# EAGLE design Circuit schematic (EAGLE 7.5.0)
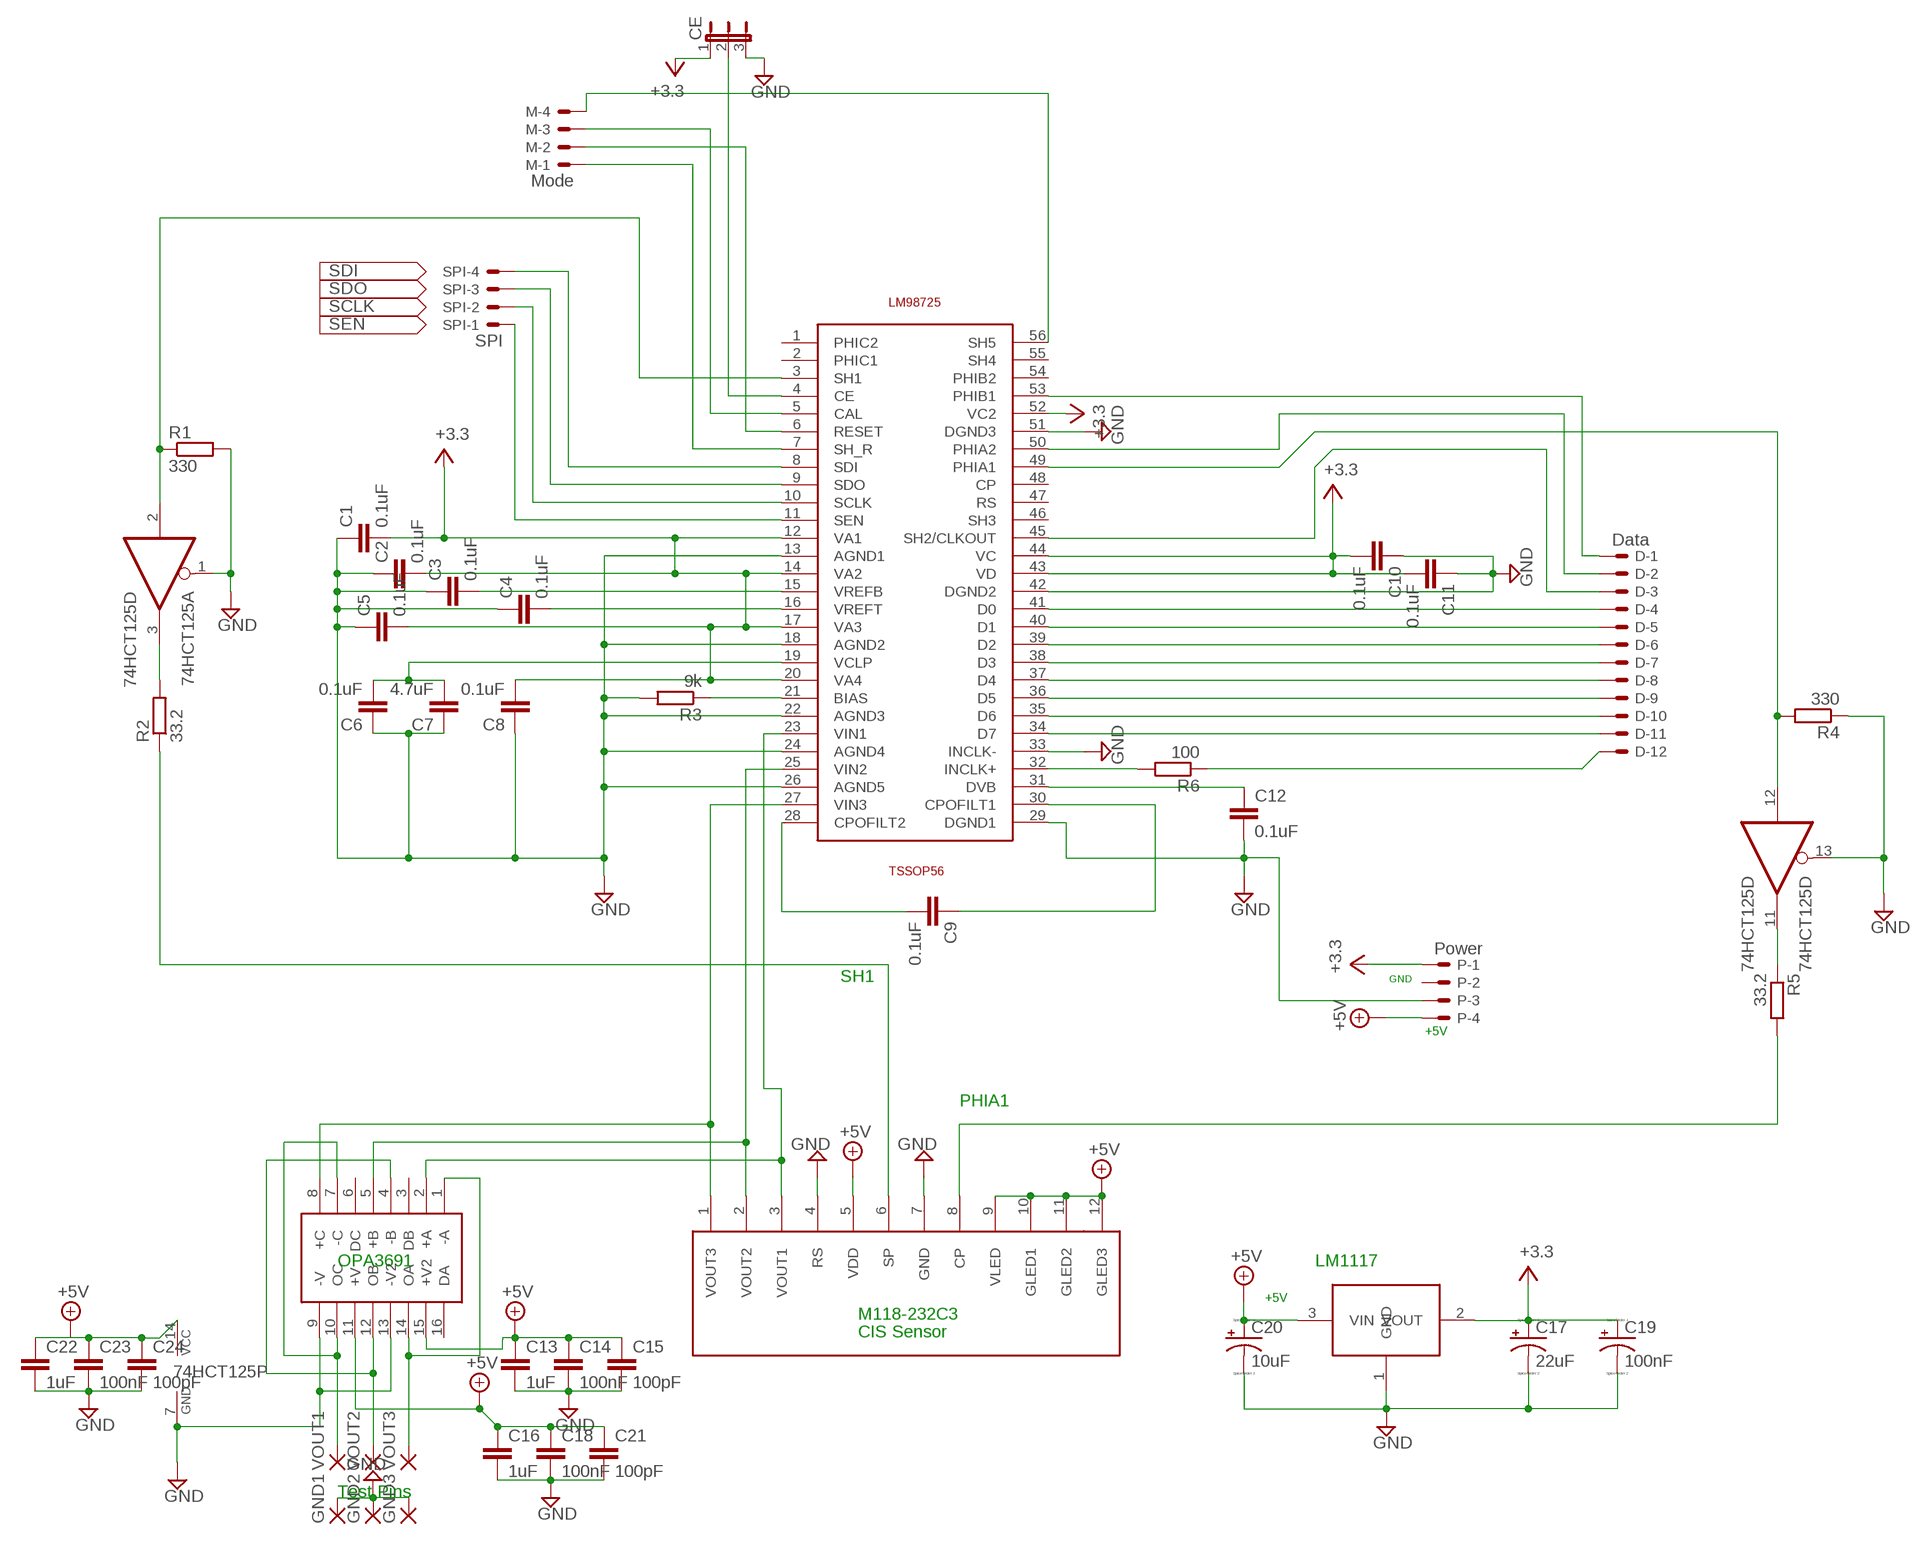
[diagram p0: schematic, sheet 1]

## Parts
74HCT125  74HCT125D  [SO14]
C1  0.1uF  C-EUC0603  [C0603]
C2  0.1uF  C-EUC0603  [C0603]
C3  0.1uF  C-EUC0603  [C0603]
C4  0.1uF  C-EUC0603  [C0603]
C5  0.1uF  C-EUC0603  [C0603]
C6  0.1uF  C-EUC0603  [C0603]
C7  4.7uF  C-EUC0603  [C0603]
C8  0.1uF  C-EUC0603  [C0603]
C9  0.1uF  C-EUC0603  [C0603]
C10  0.1uF  C-EUC0603  [C0603]
C11  0.1uF  C-EUC0603  [C0603]
C12  0.1uF  C-EUC0603  [C0603]
C13  1uF  C-EUC0603  [C0603]
C14  100nF  C-EUC0603  [C0603]
C15  100pF  C-EUC0603  [C0603]
C16  1uF  C-EUC0603  [C0603]
C17  22uF  CPOL-USD/7343-31W  [D/7343-31W]
C18  100nF  C-EUC0603  [C0603]
C19  100nF  CPOL-USA/3216-18W  [A/3216-18W]
C20  10uF  CPOL-USC/6032-28R  [C/6032-28R]
C21  100pF  C-EUC0603  [C0603]
C22  1uF  C-EUC0603  [C0603]
C23  100nF  C-EUC0603  [C0603]
C24  100pF  C-EUC0603  [C0603]
CE  JP2E  [JP2]
D  Data  53048-12  [53048-12]
GND1  3,17/1,3  [3,17/1,3]
GND2  3,17/1,3  [3,17/1,3]
GND3  3,17/1,3  [3,17/1,3]
LM98725  LM98725  [TSSOP56]
M  Mode  53048-04  [53048-04]
OPA3691  OPA3691  [SO16]
P  Power  53048-04  [53048-04]
R1  330  R-EU_R0603  [R0603]
R2  33.2  R-EU_R0603  [R0603]
R3  9k  R-EU_R0603  [R0603]
R4  330  R-EU_R0603  [R0603]
R5  33.2  R-EU_R0603  [R0603]
R6  100  R-EU_R0603  [R0603]
SENSOR  CIS-M118118  [12PINPAD]
SPI  SPI  53048-04  [53048-04]
U$2  LM117  [LM]
VOUT1  3,17/1,3  [3,17/1,3]
VOUT2  3,17/1,3  [3,17/1,3]
VOUT3  3,17/1,3  [3,17/1,3]

## Nets
+5V: 74HCT125.14(P:VCC) C13.1 C14.1 C15.1 C16.1 C18.1 C20.+ C21.1 C22.1 C23.1 C24.1 OPA3691.11(+V) OPA3691.15(+V2) P.4 SENSOR.5(VDD) SENSOR.9(VLED) SENSOR.10(GLED1) SENSOR.11(GLED2) SENSOR.12(GLED3) U$2.3(VIN)
GND: 74HCT125.1(A:OE) 74HCT125.7(P:GND) 74HCT125.13(D:OE) C1.1 C2.1 C3.1 C4.1 C5.1 C6.1 C7.1 C8.1 C10.1 C11.1 C12.2 C13.2 C14.2 C15.2 C16.2 C17.- C18.2 C19.- C20.- C21.2 C22.2 C23.2 C24.2 CE.3 GND1.1(P) GND2.1(P) GND3.1(P) LM98725.13(AGND1) LM98725.18(AGND2) LM98725.22(AGND3) LM98725.24(AGND4) LM98725.26(AGND5) LM98725.29(DGND1) LM98725.33(INCLK-) LM98725.42(DGND2) LM98725.51(DGND3) OPA3691.9(-V) OPA3691.13(-V2) P.3 R1.2 R3.2 R4.1 SENSOR.4(RS) SENSOR.7(GND) U$2.1(GND)
N$1: C9.2 LM98725.28(CPOFILT2)
N$2: C9.1 LM98725.30(CPOFILT1)
N$3: OPA3691.4(-B) OPA3691.12(OB) VOUT2.1(P)
N$4: C12.1 LM98725.31(DVB)
N$5: OPA3691.1(-A) OPA3691.14(OA) VOUT3.1(P)
N$6: OPA3691.7(-C) OPA3691.10(OC) VOUT1.1(P)
N$7: LM98725.25(VIN2) OPA3691.5(+B) SENSOR.2(VOUT2)
N$8: CE.2 LM98725.4(CE)
N$9: LM98725.32(INCLK+) R6.2
N$10: C4.2 LM98725.16(VREFT)
N$11: LM98725.8(SDI) SPI.4
N$12: LM98725.21(BIAS) R3.1
N$13: C6.2 C7.2 LM98725.19(VCLP)
N$14: LM98725.9(SDO) SPI.3
N$15: LM98725.10(SCLK) SPI.2
N$16: LM98725.5(CAL) M.3
N$17: LM98725.11(SEN) SPI.1
N$18: LM98725.6(RESET) M.2
N$19: LM98725.7(SH_R) M.1
N$20: D.12 R6.1
N$21: D.11 LM98725.34(D7)
N$22: D.3 LM98725.45(SH2/CLKOUT)
N$23: LM98725.56(SH5) M.4
N$29: D.1 LM98725.53(PHIB1)
N$30: D.2 LM98725.50(PHIA2)
N$32: D.10 LM98725.35(D6)
N$33: D.9 LM98725.36(D5)
N$34: D.8 LM98725.37(D4)
N$35: D.6 LM98725.39(D2)
N$36: D.7 LM98725.38(D3)
N$37: D.5 LM98725.40(D1)
N$38: D.4 LM98725.41(D0)
N$39: 74HCT125.3(A:O) R2.2
N$42: R5.2 SENSOR.8(CP)
N$43: LM98725.23(VIN1) OPA3691.2(+A) SENSOR.3(VOUT1)
N$46: R2.1 SENSOR.6(SP)
N$47: 74HCT125.2(A:I) LM98725.3(SH1) R1.1
N$48: C3.2 LM98725.15(VREFB)
N$50: 74HCT125.12(D:I) LM98725.49(PHIA1) R4.2
N$52: 74HCT125.11(D:O) R5.1
N$53: LM98725.27(VIN3) OPA3691.8(+C) SENSOR.1(VOUT3)
V+: C1.2 C2.2 C5.2 C8.2 C10.2 C11.2 C17.+ C19.+ CE.1 LM98725.12(VA1) LM98725.14(VA2) LM98725.17(VA3) LM98725.20(VA4) LM98725.43(VD) LM98725.44(VC) LM98725.52(VC2) P.1 U$2.2(VOUT) ; supply symbol labelled +3.3
Unconnected: 74HCT125.4(B:OE) 74HCT125.5(B:I) 74HCT125.6(B:O) 74HCT125.8(C:O) 74HCT125.9(C:I) 74HCT125.10(C:OE) LM98725.1(PHIC2) LM98725.2(PHIC1) LM98725.46(SH3) LM98725.47(RS) LM98725.48(CP) LM98725.54(PHIB2) LM98725.55(SH4) OPA3691.3(DB) OPA3691.6(DC) OPA3691.16(DA) P.2

## Notes on the sheet
- SH1 | GND
- +5V
- PHIA1
- OPA3691 | LM1117
- +5V
- M118-232C3
- CIS Sensor
- Test Pins

## Library data of the parts
74HCT125 = 74xx-eu:74*125: Quad bus BUFFER, 3-state
C1-C16 C18 C21-C24 = resistor:C-EU: CAPACITOR, European symbol
C17 C19 C20 = resistor:CPOL-US: POLARIZED CAPACITOR, American symbol
CE = jumper:JP2E: JUMPER
D = con-molex:53?-12: CONNECTOR wire to board 1.25 mm (.049 inch) pitch header; MF: WALDOM/MOLEX; MPN: 53048-1210; OC_FARNELL: unknown; OC_NEWARK: 71H4145
GND1-GND3 VOUT1-VOUT3 = wirepad:3,17/1,3: THROUGH-HOLE PAD
LM98725 = lm adc:LM
M P SPI = con-molex:53?-04: CONNECTOR wire to board 1.25 mm (.049 inch) pitch header; MF: MOLEX; MPN: 53048-0410; OC_FARNELL: 1462887; OC_NEWARK: 57H4721
OPA3691 = burr-brown:OPA3691
R1-R6 = resistor:R-EU_: RESISTOR, European symbol
SENSOR = CIS-M118:CIS-M118
U$2 = lm1117:LM

## Board
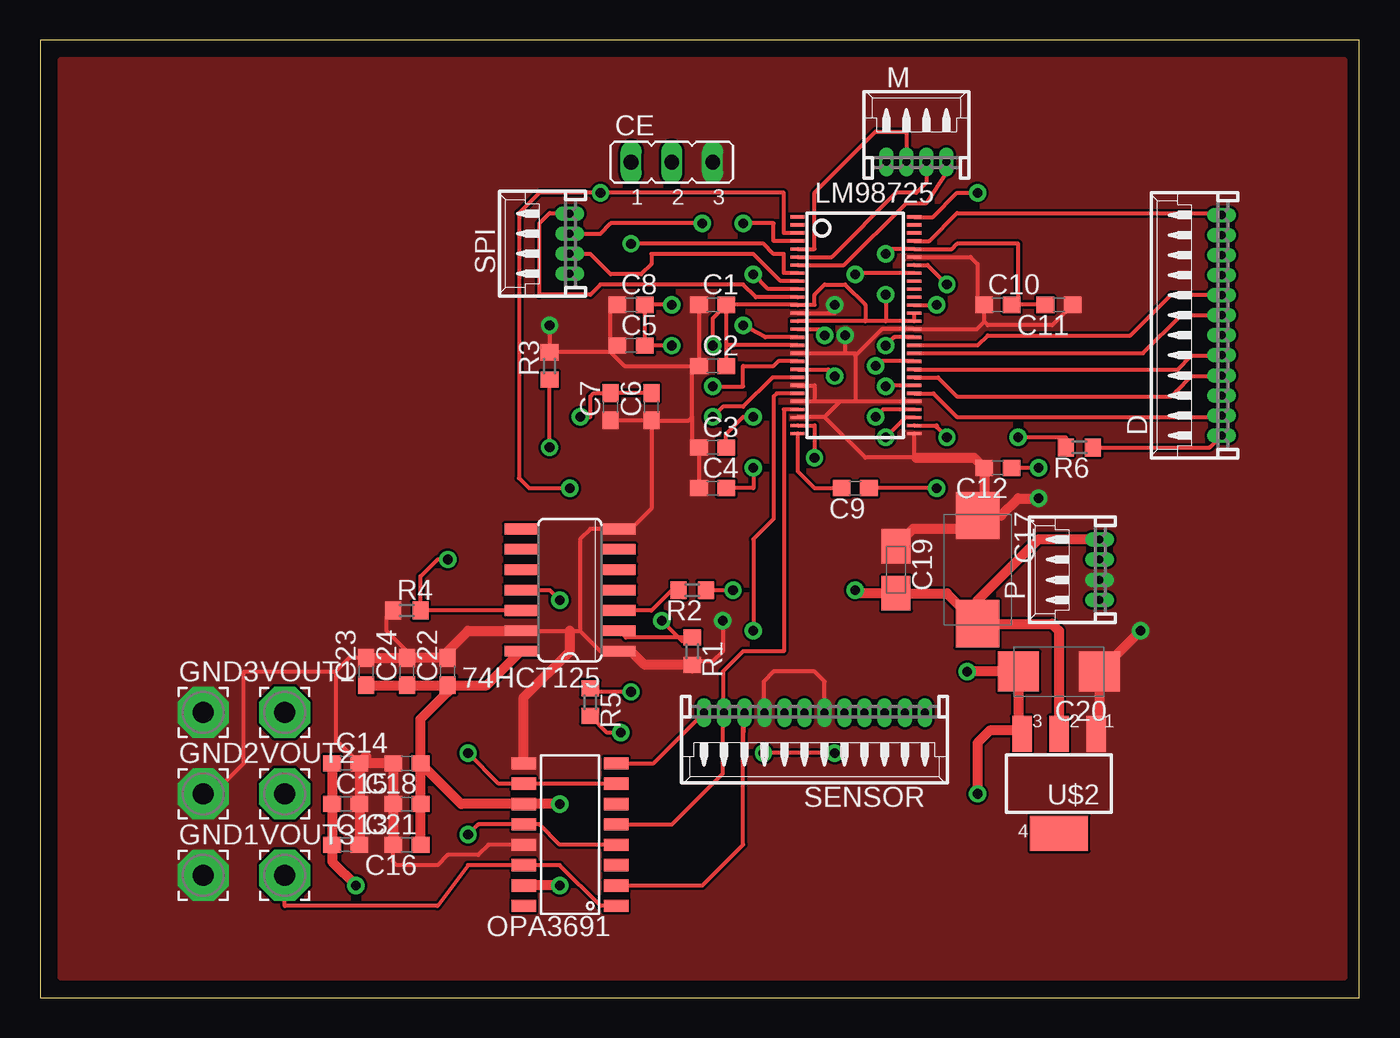
[diagram p1: board, top side]
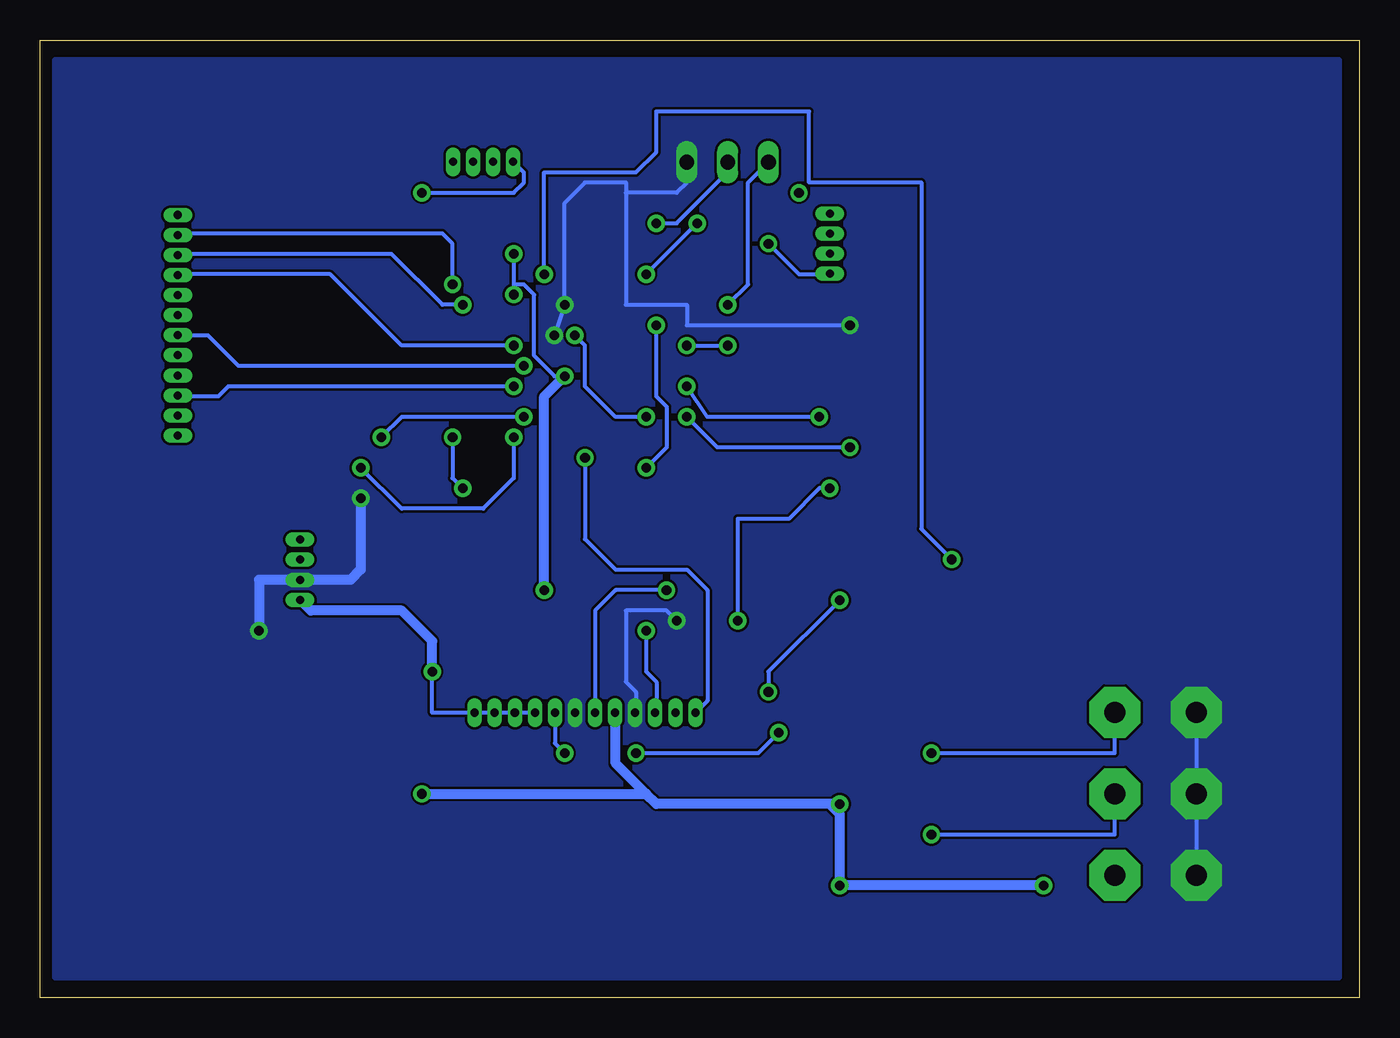
[diagram p2: board, bottom side, seen from below]

Size 82.22 x 59.68 mm. Coordinates in mm from the lower left corner, seen from the top.
Outline: 0,0 82.22,0 82.22,59.68 0,59.68 0,0
Copper layers (1*16): Top 0.035mm / dielectric 1.5mm / Bottom 0.035mm
Design rules "PCB-POOL Standard": minimum track width 0.15mm, minimum drill 0.3mm, track to track 0.15mm, track to pad 0.15mm, pad to pad 0.15mm, via to via 0.15mm, smd to smd 0.15mm, copper to edge 0.3mm, drill to drill 0.2mm, minimum pad ring 0.2mm, minimum via ring 0.15mm, stop-mask expansion 0.075mm, vias tented up to drill 0mil, thermal gap 0.2mm

### Footprints (pad centres in the part's own frame; a part is rotated, then mirrored left to right if it is on the bottom)
SO14 = smd 0.66 x 2.032: 1 -3.81,-3.073; 2 -2.54,-3.073; 3 -1.27,-3.073; 4 0,-3.073; 5 1.27,-3.073; 6 2.54,-3.073; 7 3.81,-3.073; 8 3.81,3.073; 9 2.54,3.073; 10 1.27,3.073; 11 0,3.073; 12 -1.27,3.073; 13 -2.54,3.073; 14 -3.81,3.073
C0603 = smd 1.1 x 1: 1 -0.85,0; 2 0.85,0
D/7343-31W = smd 2.95 x 2.7: + 3.375,0; - -3.375,0
A/3216-18W = smd 2.15 x 1.8: + 1.475,0; - -1.475,0
C/6032-28R = smd 2.55 x 2.5: + 2.525,0; - -2.525,0
JP2 = drill 0.914 long: 1 -2.54,0; 2 0,0; 3 2.54,0
53048-12 = drill 0.5 pad 0.698 long: 1 6.875,-1.25; 2 5.625,-1.25; 3 4.375,-1.25; 4 3.125,-1.25; 5 1.875,-1.25; 6 0.625,-1.25; 7 -0.625,-1.25; 8 -1.875,-1.25; 9 -3.125,-1.25; 10 -4.375,-1.25; 11 -5.625,-1.25; 12 -6.875,-1.25
3,17/1,3 = drill 1.321 pad 3.175 octagon: 1 0,0
TSSOP56 = smd 0.2 x 0.9: 1 -10.56,-2.33; 2 -10.06,-2.33; 3 -9.56,-2.33; 4 -9.06,-2.33; 5 -8.56,-2.33; 6 -8.06,-2.33; 7 -7.56,-2.33; 8 -7.06,-2.33; 9 -6.56,-2.33; 10 -6.06,-2.33; 11 -5.56,-2.33; 12 -5.06,-2.33; 13 -4.56,-2.33; 14 -4.06,-2.33; 15 -3.56,-2.33; 16 -3.06,-2.33; 17 -2.56,-2.33; 18 -2.06,-2.33; 19 -1.56,-2.33; 20 -1.06,-2.33; 21 -0.56,-2.33; 22 -0.06,-2.33; 23 0.44,-2.33; 24 0.94,-2.33; 25 1.44,-2.33; 26 1.94,-2.33; 27 2.44,-2.33; 28 2.94,-2.33; 29 2.94,4.93; 30 2.44,4.93; 31 1.94,4.93; 32 1.44,4.93; 33 0.94,4.93; 34 0.44,4.93; 35 -0.06,4.93; 36 -0.56,4.93; 37 -1.06,4.93; 38 -1.56,4.93; 39 -2.06,4.93; 40 -2.56,4.93; 41 -3.06,4.93; 42 -3.56,4.93; 43 -4.06,4.93; 44 -4.56,4.93; 45 -5.06,4.93; 46 -5.56,4.93; 47 -6.06,4.93; 48 -6.56,4.93; 49 -7.06,4.93; 50 -7.56,4.93; 51 -8.06,4.93; 52 -8.56,4.93; 53 -9.06,4.93; 54 -9.56,4.93; 55 -10.06,4.93; 56 -10.56,4.93
53048-04 = drill 0.5 pad 0.698 long: 1 1.875,-1.25; 2 0.625,-1.25; 3 -0.625,-1.25; 4 -1.875,-1.25
SO16 = smd 0.762 x 1.524: 1 -4.445,-2.875; 2 -3.175,-2.875; 3 -1.905,-2.875; 4 -0.635,-2.875; 5 0.635,-2.875; 6 1.905,-2.875; 7 3.175,-2.875; 8 4.445,-2.875; 9 4.445,2.875; 10 3.175,2.875; 11 1.905,2.875; 12 0.635,2.875; 13 -0.635,2.875; 14 -1.905,2.875; 15 -3.175,2.875; 16 -4.445,2.875
R0603 = smd 1 x 1.1: 1 -0.85,0; 2 0.85,0
12PINPAD = drill 0.5 pad 0.698 long: 1 -9.415,2.52; 2 -8.165,2.52; 3 -6.915,2.52; 4 -5.665,2.52; 5 -4.415,2.52; 6 -3.165,2.52; 7 -1.915,2.52; 8 -0.665,2.52; 9 0.585,2.52; 10 1.835,2.52; 11 3.085,2.52; 12 4.335,2.52
LM = smd 1.219 x 2.235: 1 -2.311,-3.099; 2 0,-3.099; 3 2.311,-3.099 | smd 3.6 x 2.2: 4 0,3.099

### Placement (x,y rotation side)
74HCT125  33.02,25.4 90 top
C1  41.91,43.18 0 top
C2  41.91,39.37 0 top
C3  41.91,34.29 0 top
C4  41.91,31.75 0 top
C5  36.83,40.64 0 top
C6  38.1,36.83 90 top
C7  35.56,36.83 90 top
C8  36.83,43.18 0 top
C9  50.8,31.75 180 top
C10  59.69,43.18 0 top
C11  63.5,43.18 180 top
C12  59.69,33.02 180 top
C13  19.05,9.52 0 top
C14  19.05,14.61 0 top
C15  19.05,12.06 0 top
C16  22.86,9.52 180 top
C17  58.42,26.67 270 top
C18  22.86,14.61 180 top
C19  53.34,26.67 270 top
C20  63.5,20.32 180 top
C21  22.86,12.06 180 top
C22  25.4,20.32 90 top
C23  20.32,20.32 90 top
C24  22.86,20.32 90 top
CE  39.37,52.07 0 top
D  72.39,41.91 90 top
GND1  10.16,7.62 0 top
GND2  10.16,12.7 0 top
GND3  10.16,17.78 0 top
LM98725  49.53,38.1 270 top
M  54.61,53.34 0 top
OPA3691  33.02,10.16 90 top
P  64.77,26.67 90 top
R1  40.64,21.59 270 top
R2  40.64,25.4 180 top
R3  31.75,39.37 90 top
R4  22.86,24.13 0 top
R5  34.29,18.41 270 top
R6  64.77,34.29 180 top
SENSOR  50.8,15.24 0 top
SPI  31.75,46.99 90 top
U$2  63.5,13.34 180 top
VOUT1  15.24,17.78 0 top
VOUT2  15.24,12.7 0 top
VOUT3  15.24,7.62 0 top

### Tracks (layer width: path | path; a pad name or v marks a point on that pad's centre or on a via)
+5V  (via drill 0.6 pad 0.61)
  Top 0.61: 60.98,16.65 C20.+ v57.79,20.32 | 60.98,16.65 U$2.3 | C18.1 26.25,12.06 OPA3691.11 v32.38,12.06 | C14.1 C15.1 C13.1 18.2,8.47 v19.68,6.98 | C16.1 C21.1 C18.1 | 60.98,16.65 59.19,16.65 58.42,15.88 v58.42,12.7 | v32.38,6.98 OPA3691.15 | C22.1 C24.1 C23.1 | C18.1 23.71,17.36 25.4,19.05 C22.1 | C22.1 27.83,19.47 74HCT125.14
  Bottom 0.254: SENSOR.9 SENSOR.10 SENSOR.11 SENSOR.12 57.79,17.76 v57.79,20.32
  Bottom 0.61: v32.38,12.06 33.02,12.06 | 33.02,12.06 43.81,12.06 44.45,12.7 | 44.45,12.7 46.35,14.61 46.35,17.73 SENSOR.5 | v58.42,12.7 44.45,12.7 | v57.79,20.32 57.79,22.22 59.69,24.13 65.35,24.13 P.4 | 33.02,12.06 32.38,11.43 v32.38,6.98 v19.68,6.98
GND  (via drill 0.6, 0.6 pad 0.25, 0.6 pad 0.61)
  Top 0.254: LM98725.51 57.98,46.16 58.42,45.72 58.42,43.6 C10.1 58.84,42.12 | C4.1 C3.1 40.64,34.71 40.64,36.2 | C6.1 C7.1 | 35.56,40.64 35.56,40.22 | 35.56,40.22 R3.2 v31.75,41.91 | C5.1 35.56,40.64 | 35.56,40.64 35.56,43.18 C8.1 | C11.1 63.08,41.91 59.05,41.91 58.84,42.12 | 58.84,42.12 58.38,41.66 LM98725.42 52.45,41.66 50.8,40.01 | C6.1 38.1,30.48 36.83,29.21 74HCT125.7 34.29,29.21 33.66,28.58 33.66,22.86 | 49.86,37.16 48.26,37.16 | 48.26,37.16 LM98725.24 | LM98725.33 50.8,37.16 | 50.8,37.16 49.86,37.16 | 49.86,37.16 48.9,36.2 | 48.9,36.2 47.23,36.2 LM98725.26 | LM98725.29 54.46,33.8 54.61,33.66 51.44,33.66 48.9,36.2 | 33.66,22.86 34.92,21.59 74HCT125.1 | 47.05,38.16 LM98725.22 48.26,38.16 48.26,37.16 | LM98725.18 50.16,40.16 | 50.16,40.16 50.8,40.16 50.8,40.01 | C6.1 40.42,35.98 40.64,36.2 | 40.64,36.2 40.64,38.95 C2.1 | C2.1 40.64,39.37 | C1.1 40.64,43.18 41.06,42.76 C2.1 | 50.8,40.01 50.8,37.16 | 74HCT125.13 33.02,22.86 33.66,22.86 | 35.56,40.22 36.41,39.37 C2.1 | v50.16,41.27 50.16,40.16 | 45.09,17.71 SENSOR.4 | 40.64,20.32 R1.2 40.85,20.95 41.91,20.95 42.55,21.59 v42.55,23.49 | SENSOR.7 48.88,19.7 48.26,20.32 45.72,20.32 45.09,19.68 45.09,17.81 SENSOR.4 | 45.16,17.78 SENSOR.4 | GND2.1 10.8,12.7 12.7,14.61 12.7,20.32 18.41,20.32 | C23.2 19.27,21.17 18.41,20.32 | 18.41,20.32 18.41,15.88 18.63,15.88 C14.2 | C24.2 22.86,21.59 21.59,22.86 21.59,23.71 R4.1 | OPA3691.13 27.94,9.52 27.3,8.89 25.4,8.89 24.77,8.25 22.23,8.25 22.01,8.47 C16.2 | LM98725.13 49.53,42.66 v49.53,43.18 arc-90 49.01,42.66 LM98725.13
  Top 0.61: 54.61,33.66 58.21,33.66 C12.2 58.84,30.9 | 58.84,30.9 57.15,29.21 54.4,29.21 C19.- | v62.23,31.12 60.96,31.12 59.89,30.05 C17.- 58.84,30.46 58.84,30.9 | v68.58,22.86 C20.- 66.03,16.65 U$2.1 | C16.2 C21.2 C18.2 C14.2 | 19.68,14.61 C14.2 | C14.2 C15.2 C13.2 | OPA3691.9 30.15,18.71 33.02,21.59 33.02,22.86 | R1.2 37.68,20.74 36.83,21.59 74HCT125.1 | C23.2 C24.2 C22.2 25.4,21.59 26.67,22.86 74HCT125.13 | 20.32,15.02 C14.2
  Bottom 0.254: v50.16,41.27 v49.53,43.18 49.53,49.53 48.26,50.8 45.72,50.8 45.72,50.16 | 45.72,50.16 45.72,43.18 41.91,43.18 41.91,41.91 v31.75,41.91 | GND3.1 GND2.1 GND1.1 | v42.55,23.49 43.18,24.13 45.72,24.13 45.72,19.68 45.09,19.05 45.09,17.81 SENSOR.4 | CE.3 41.91,50.8 42.55,50.16 45.72,50.16
  Bottom 0.61: v62.23,31.12 62.23,26.67 62.87,26.03 66.01,26.03 P.3 67.94,26.05 67.94,26.03 68.58,26.03 v68.58,22.86
  pour Bottom (no thermals): 1.27,58.42 81.28,58.42 81.28,49.53 81.28,1.27 1.27,1.27
  pour Top (no thermals): 1.27,58.42 81.28,58.42 81.28,1.27 1.27,1.27
N$1
  Top 0.254: LM98725.28 47.2,32.81 48.26,31.75 C9.2
N$2  (via drill 0.6)
  Top 0.254: v56.51,34.92 55.88,35.56 55.88,35.66 LM98725.30 | v55.88,31.75 C9.1
  Bottom 0.254: v56.51,34.92 56.51,32.38 v55.88,31.75
N$3  (via drill 0.6 pad 0.61)
  Top 0.254: OPA3691.4 32.38,9.52 31.12,10.79 OPA3691.12 27.3,10.79 v26.67,10.16
  Bottom 0.254: v26.67,10.16 15.24,10.16 VOUT2.1
N$4  (via drill 0.6)
  Top 0.254: 60.32,33.23 C12.1 v62.23,33.02 | LM98725.31 53.94,36.16 v52.71,34.92
  Bottom 0.254: v52.71,34.92 52.71,32.38 54.61,30.48 59.69,30.48 v62.23,33.02
N$5
  Top 0.254: OPA3691.1 34.92,5.71 32.38,8.25 OPA3691.14 26.67,8.25 24.77,5.71 15.24,5.71 VOUT3.1
N$6  (via drill 0.6 pad 0.25)
  Top 0.254: OPA3691.10 30.48,13.34 | OPA3691.7 OPA3691.10 | OPA3691.10 28.58,13.34 v26.67,15.24
  Bottom 0.254: v26.67,15.24 15.24,15.24 VOUT1.1
N$7
  Top 0.254: OPA3691.5 39.37,10.79 42.55,13.97 42.55,17.67 SENSOR.2 42.55,17.85 42.55,20.32 43.81,21.59 46.35,21.59 46.35,36.66 LM98725.25
  Bottom 0.254: 42.55,17.85 SENSOR.2
N$8  (via drill 0.6 pad 0.61)
  Top 0.254: LM98725.4 45.72,47.16 45.72,48.26 v43.81,48.26
  Bottom 0.254: v43.81,48.26 42.55,48.26 39.37,51.44 CE.2
N$9  (via drill 0.6 pad 0.25)
  Top 0.254: LM98725.32 52.54,36.66 v52.07,36.2 | v60.96,34.92 63.92,34.92 R6.2
  Bottom 0.254: v52.07,36.2 59.69,36.2 v60.96,34.92
N$10  (via drill 0.6 pad 0.25)
  Top 0.254: LM98725.16 45.2,41.16 v43.81,41.91 | v44.45,33.02 44.45,31.75 C4.2
  Bottom 0.254: v44.45,33.02 43.18,34.29 43.18,36.83 43.81,37.46 v43.81,41.91
N$11  (via drill 0.6 pad 0.61)
  Top 0.254: LM98725.8 46.35,45.16 46.35,46.35 45.72,46.35 45.09,46.99 v36.83,46.99
  Bottom 0.254: v36.83,46.99 34.92,45.09 33.03,45.09 SPI.4
N$12  (via drill 0.6 pad 0.25)
  Top 0.254: 31.75,38.1 R3.1 v31.75,34.29 | LM98725.21 45.65,38.66 43.81,36.83 42.55,36.83 v41.91,36.2
  Bottom 0.254: v31.75,34.29 40.01,34.29 v41.91,36.2
N$13  (via drill 0.6 pad 0.25)
  Top 0.254: v33.66,36.2 34.29,36.2 34.29,37.46 34.51,37.68 C7.2 | 35.56,37.46 C7.2 | LM98725.19 46.01,39.66 45.72,39.37 43.81,39.37 43.81,38.1 v41.91,38.1 | C6.2 38.1,38.1 37.68,37.68 C7.2
  Bottom 0.254: v33.66,36.2 40.64,36.2 v41.91,38.1
N$14
  Top 0.254: LM98725.9 46.15,44.66 44.45,46.35 38.1,46.35 38.1,45.72 37.47,45.09 35.56,45.09 34.29,46.35 33.01,46.35 SPI.3
N$15  (via drill 0.6 pad 0.61)
  Top 0.254: LM98725.10 45.38,44.16 v44.45,45.09 | v41.27,48.26 35.56,48.26 34.91,47.62 SPI.2
  Bottom 0.254: v44.45,45.09 v41.27,48.26
N$16
  Top 0.254: 53.99,51.45 M.3 53.99,53.96 53.98,53.98 52.07,53.98 48.26,50.16 48.26,46.66 LM98725.5
N$17
  Top 0.254: LM98725.11 44.6,43.66 43.81,44.45 34.92,44.45 34.29,43.81 31.12,43.81 31.12,48.26 31.75,48.89 32.97,48.89 SPI.1
N$18
  Top 0.254: M.2 55.24,50.79 54.61,50.16 53.34,50.16 49.34,46.16 LM98725.6
N$19
  Top 0.254: LM98725.7 50.1,45.66 53.98,49.53 55.24,49.53 56.51,51.44 M.1 56.51,52.06
N$20
  Top 0.254: 73.64,34.71 D.12 72.9,34.29 R6.1
N$21
  Top 0.254: D.11 73.55,36.2 57.15,36.2 55.68,37.66 LM98725.34
N$22  (via drill 0.6)
  Top 0.254: LM98725.45 55.86,43.16 v55.88,43.18
  Bottom 0.254: v55.88,43.18 57.15,43.18 60.32,46.35 73.57,46.35 D.3
N$23  (via drill 0.6 pad 0.61)
  Top 0.254: LM98725.56 55.65,48.66 57.15,50.16 v58.42,50.16
  Bottom 0.254: v58.42,50.16 52.71,50.16 52.07,50.8 52.07,51.42 M.4
N$29
  Top 0.254: LM98725.53 55.41,47.16 57.15,48.89 73.53,48.89 D.1
N$30  (via drill 0.6)
  Top 0.254: LM98725.50 55.3,45.66 v56.51,44.45
  Bottom 0.254: v56.51,44.45 56.51,46.99 57.15,47.62 73.55,47.62 D.2
N$32  (via drill 0.6)
  Top 0.254: LM98725.35 52.71,38.16 v52.71,38.1
  Bottom 0.254: v52.71,38.1 70.49,38.1 71.12,37.46 73.57,37.46 D.10
N$33
  Top 0.254: 73.51,38.66 D.9 73.59,38.73 71.75,38.73 70.8,37.78 70.49,37.46 57.15,37.46 55.96,38.66 LM98725.36
N$34
  Top 0.254: D.8 73.61,40.01 71.75,40.01 70.91,39.16 LM98725.37
N$35
  Top 0.254: LM98725.39 68.74,40.16 71.12,42.55 73.63,42.55 D.6
N$36  (via drill 0.6)
  Top 0.254: D.7 | LM98725.38 52.36,39.66 v52.07,39.37
  Bottom 0.254: v52.07,39.37 69.85,39.37 71.75,41.27 D.7
N$37
  Top 0.254: LM98725.40 58.44,40.66 59.05,41.27 67.94,41.27 70.49,43.81 73.61,43.81 D.5
N$38  (via drill 0.6 pad 0.25)
  Top 0.254: LM98725.41 53.23,41.16 v52.71,40.64
  Bottom 0.254: D.4 73.59,45.09 64.13,45.09 59.69,40.64 v52.71,40.64
N$39
  Top 0.254: R2.2 39.37,25.4 38.1,24.13 74HCT125.3
N$42  (via drill 0.6 pad 0.61)
  Top 0.254: v49.53,15.24 v45.09,15.24 | v36.2,16.51 35.34,16.51 R5.2
  Bottom 0.254: SENSOR.8 50.13,15.84 v49.53,15.24 | v45.09,15.24 37.47,15.24 v36.2,16.51
N$43  (via drill 0.6 pad 0.61)
  Top 0.254: LM98725.23 45.91,37.66 45.72,37.46 45.72,29.84 44.45,28.58 v44.45,22.86 | 43.81,17.14 43.81,15.29 SENSOR.3 43.81,17.69 43.81,9.52 41.27,6.98 OPA3691.2
  Bottom 0.254: v44.45,22.86 44.45,20.32 43.81,19.68 43.81,17.83 SENSOR.3
N$46  (via drill 0.6 pad 0.61)
  Top 0.254: R2.1 v43.18,25.4
  Bottom 0.254: v43.18,25.4 46.35,25.4 47.62,24.13 SENSOR.6
N$47  (via drill 0.6, 0.6 pad 0.25, 0.6 pad 0.61)
  Top 0.254: 74HCT125.2 36.51,22.44 R1.1 40.85,22.22 40.01,22.22 v38.73,23.49 | LM98725.3 46.35,47.66 46.35,50.16 v34.92,50.16 31.12,50.16 29.84,48.89 29.84,32.38 30.48,31.75 v33.02,31.75
  Bottom 0.254: v38.73,23.49 38.73,29.84 35.56,29.84 33.66,31.75 v33.02,31.75
N$48  (via drill 0.6 pad 0.25)
  Top 0.254: C3.2 42.76,35.14 43.81,36.2 v44.45,36.2 | LM98725.15 48.51,41.66 arc-90 v48.9,41.27
  Bottom 0.254: v44.45,36.2 46.35,36.2 48.26,38.1 48.26,40.64 v48.9,41.27
N$50  (via drill 0.6, 0.6 pad 0.61)
  Top 0.254: LM98725.49 50.8,45.16 v50.8,45.09 | v25.4,27.3 24.77,27.3 23.71,26.25 R4.2 74HCT125.12
  Bottom 0.254: v50.8,45.09 50.8,51.44 45.09,51.44 43.81,52.7 43.81,55.25 34.29,55.25 34.29,50.8 27.3,50.8 27.3,29.21 v25.4,27.3
N$52  (via drill 0.6 pad 0.61)
  Top 0.254: 74HCT125.11 31.75,25.4 v32.38,24.77 | v36.83,19.05 34.51,19.05 R5.1
  Bottom 0.254: v32.38,24.77 36.83,20.32 v36.83,19.05
N$53  (via drill 0.6 pad 0.25)
  Top 0.254: LM98725.27 48.26,35.66 v48.26,33.66 | OPA3691.8 38.23,14.61 SENSOR.1
  Bottom 0.254: v48.26,33.66 48.26,28.58 46.35,26.67 41.91,26.67 40.64,25.4 40.64,18.5 SENSOR.1
V+  (via drill 0.6, 0.6 pad 0.25)
  Top 0.254: LM98725.44 LM98725.43 52.71,42.16 | 47.2,43.18 48.26,43.18 48.26,43.81 48.9,44.45 50.16,44.45 51.44,43.18 51.44,42.16 | LM98725.12 47.2,43.18 | 47.2,43.18 C1.2 | C1.2 42.76,40.64 | 42.76,40.64 C2.2 | C11.2 C10.2 60.96,43.18 60.96,46.99 57.15,46.99 56.82,46.66 LM98725.52 52.71,46.66 v52.71,46.35 | 52.71,42.16 51.44,42.16 | 51.44,42.16 LM98725.14 | v52.71,43.81 52.71,42.16 | v39.37,43.18 C8.2 C5.2 v39.37,40.64 | 42.76,40.64 42.78,40.66 43.18,40.66 43.18,40.64 43.2,40.66 LM98725.17 | C1.2 41.91,42.33 v41.91,40.64 | LM98725.20 49.1,39.16 v49.53,38.73
  Top 0.61: C17.+ 56.52,25.2 C19.+ 51.01,25.2 v50.8,25.4 | C17.+ 58.42,24.77 62.23,28.58 65.99,28.58 P.1 | C17.+ 63.07,23.3 63.5,22.86 U$2.2
  Bottom 0.254: 52.71,44.45 v52.71,43.81 | v39.37,43.18 38.1,44.45 38.1,50.8 CE.1 | 52.71,44.45 52.07,44.45 51.44,43.81 51.44,40.01 50.16,38.73 v49.53,38.73 | v41.91,40.64 v39.37,40.64 | v52.71,46.35 52.71,44.45
  Bottom 0.61: v50.8,25.4 50.8,37.46 v49.53,38.73